# EAGLE design logger_2G_GSM (EAGLE 7.7.0)
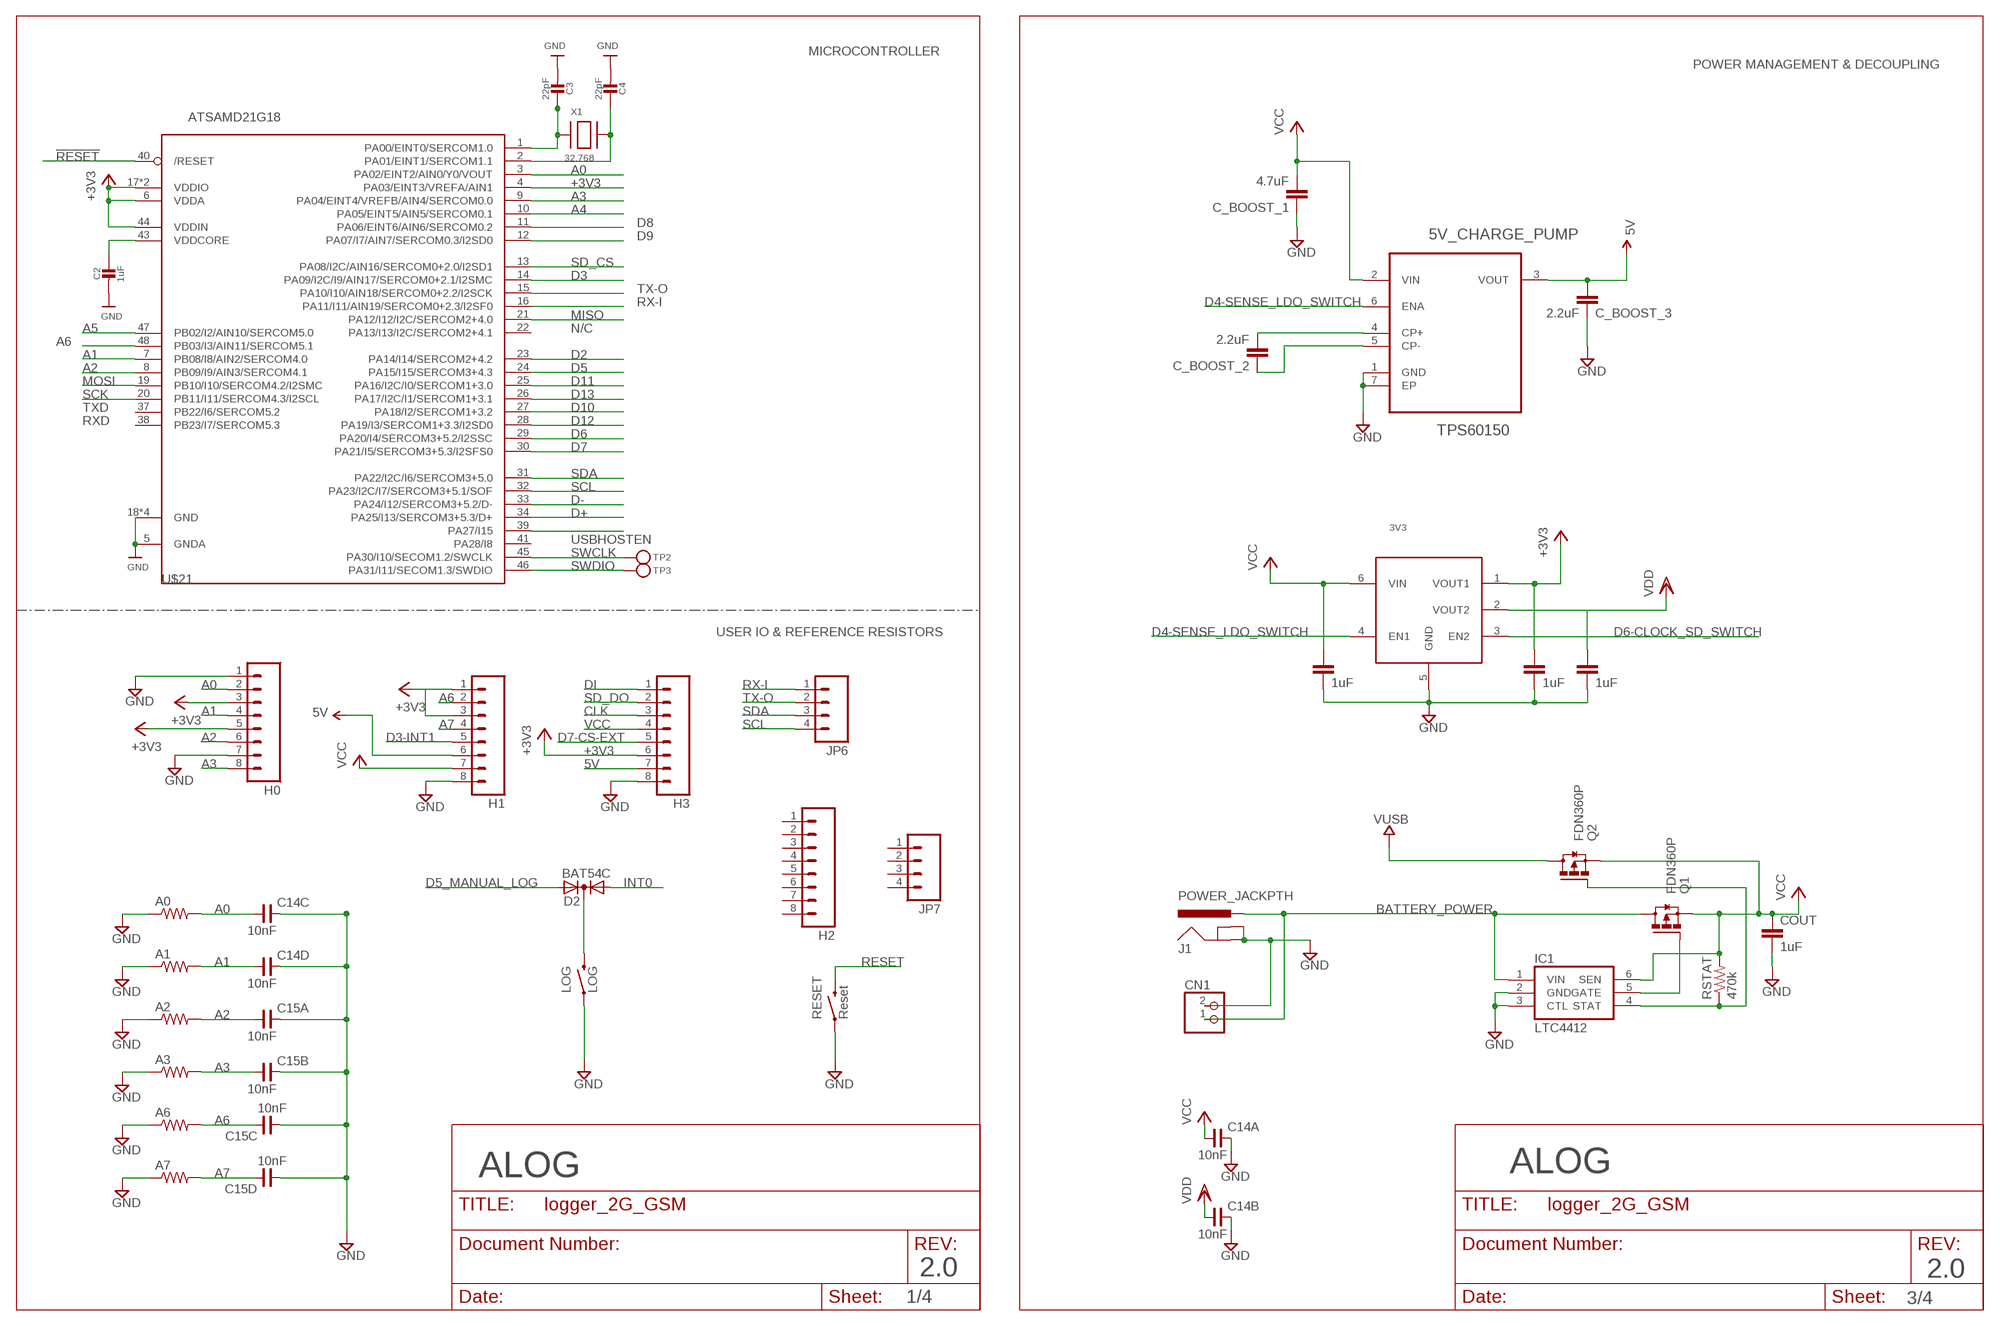
[diagram p0: schematic, sheet 1, part 1 of 2]
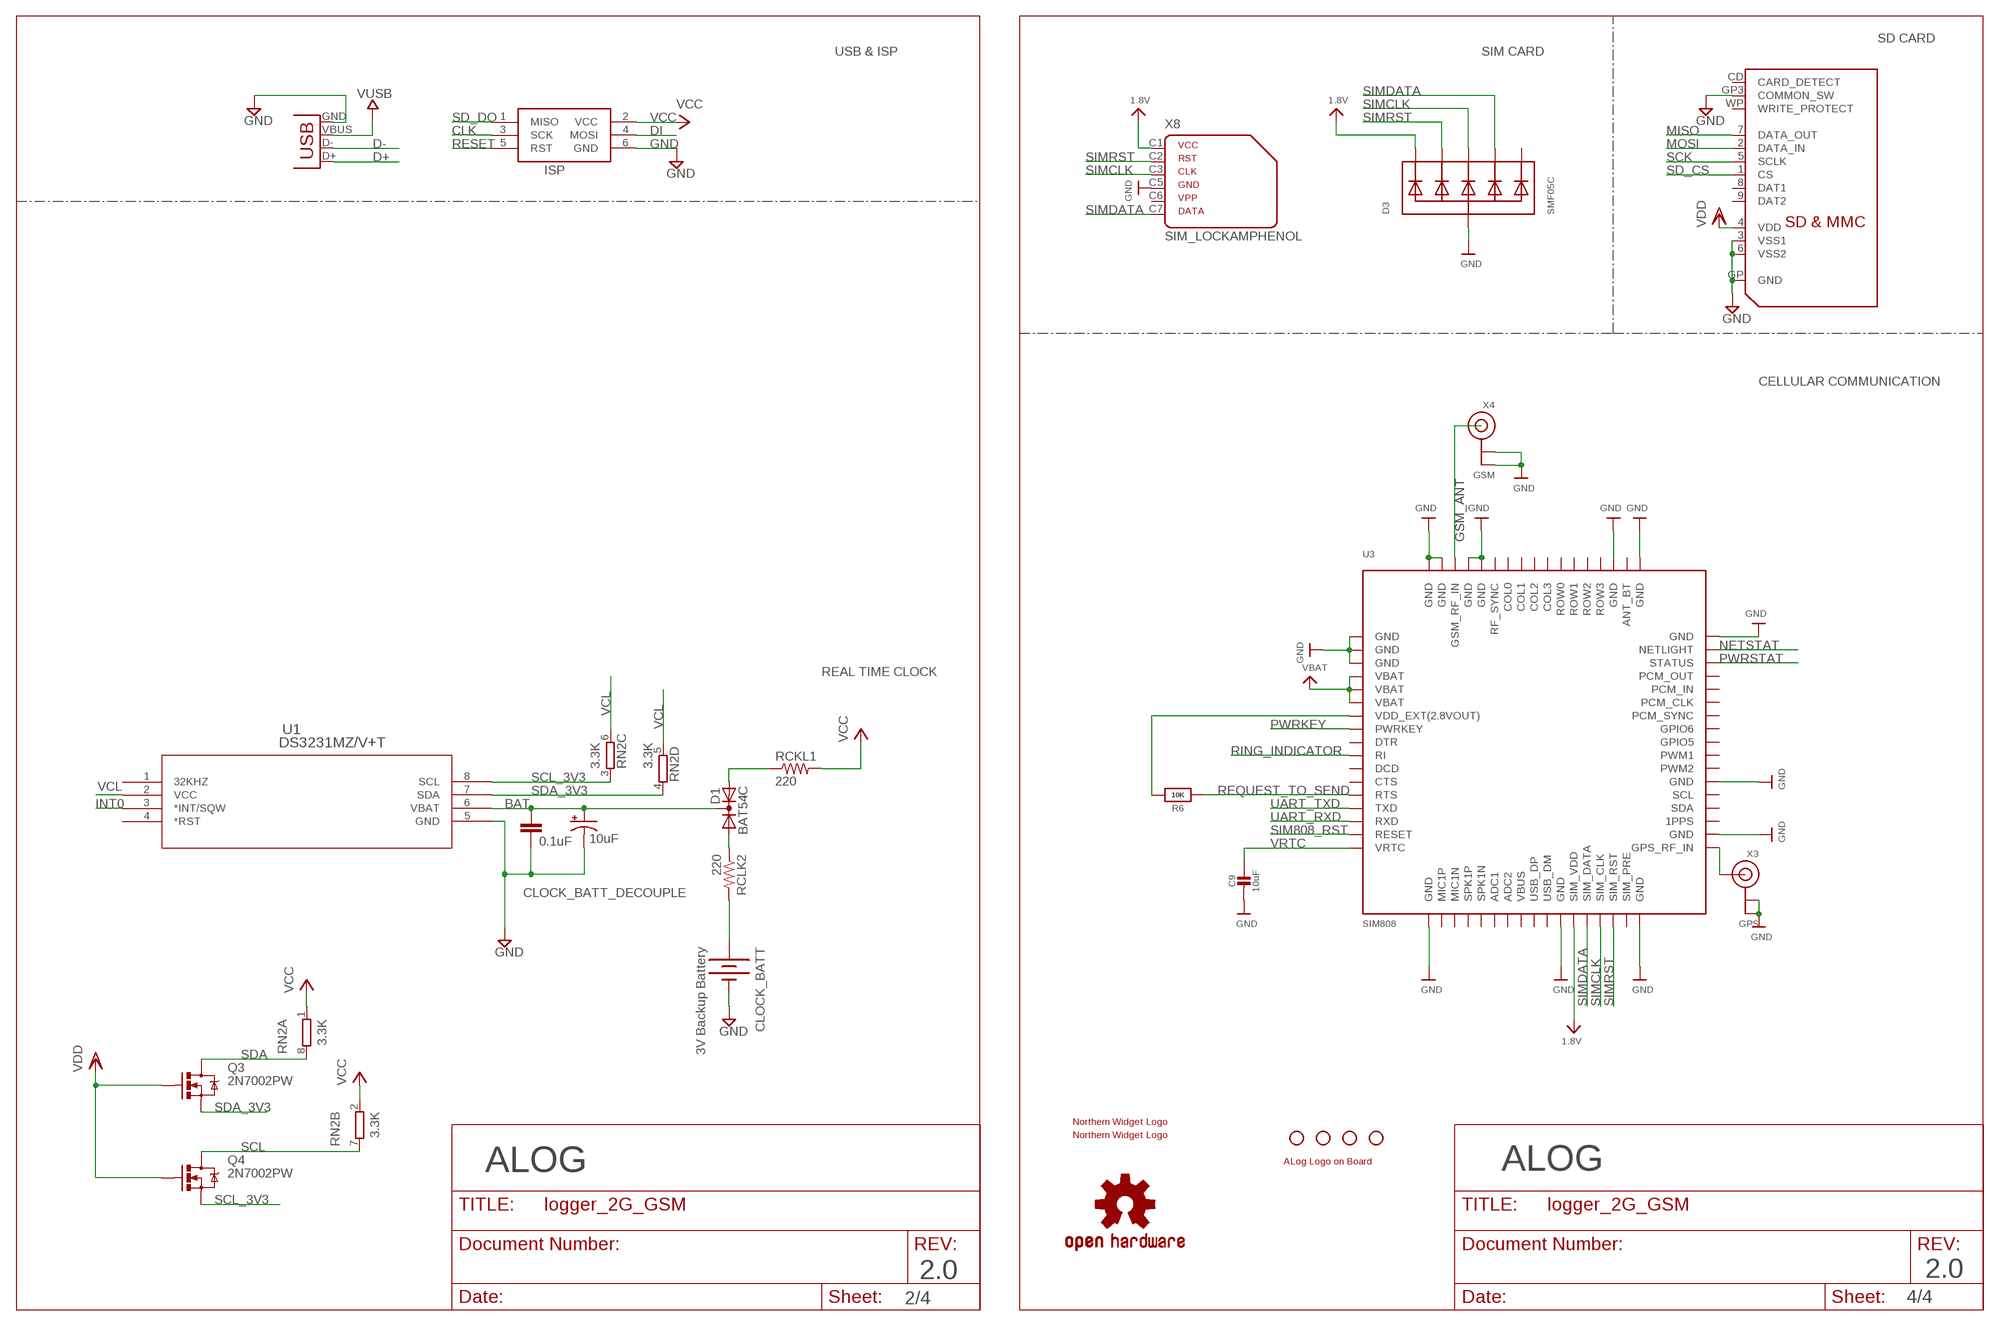
[diagram p1: schematic, sheet 1, part 2 of 2]

## Parts
3V3  MIC5380  [6-TMLF]
5V_CHARGE_PUMP  TPS60150  TPS60150DRVR  [SON65P200X200X80-7N]
A0  R-US_0207/10  [0207/10]
A1  R-US_0207/10  [0207/10]
A2  R-US_0207/10  [0207/10]
A3  R-US_0207/10  [0207/10]
A6  R-US_0207/10  [0207/10]
A7  R-US_0207/10  [0207/10]
C2  1uF  CAP_CERAMIC0603_NO  [0603-NO]
C3  22pF  CAP_CERAMIC0603_NO  [0603-NO]
C4  22pF  CAP_CERAMIC0603_NO  [0603-NO]
C9  10uF  CAP_CERAMIC0805-NOOUTLINE  [0805-NO]
C14  10nF  CCA_ECJ-1206  [CECJ-1206]
C15  10nF  CCA_ECJ-1206  [CECJ-1206]
C_BOOST_1  4.7uF  C-EUC0603  [C0603]
C_BOOST_2  2.2uF  C-EUC0603  [C0603]
C_BOOST_3  2.2uF  C-EUC0603  [C0603]
CLOCK_BATT  3V Backup Battery  BATTERY12PTH  [BATTCON_12MM_PTH]
CLOCK_BATT_DECOUP  0.1uF  C-EUC0603  [C0603]
CLOCK_BATT_DECOUPLE  10uF  CAP_POL1206  [EIA3216]
CLOCK_CIN1  1uF  C-EUC0603  [C0603]
CLOCK_CIN2  1uF  C-EUC0603  [C0603]
CLOCK_CIN3  1uF  C-EUC0603  [C0603]
CN1  JST_2PIN-THM  [JST-PH-2-THM]
COUT  1uF  C-EUC0603  [C0603]
D1  BAT54C  DIODE_AC-CA_  [SOT23C]
D2  BAT54C  DIODE_AC-CA_  [SOT23C]
D3  SMF05C  TVSARRAY_5LANE  [SOT363]
H0  M083.5MM-8  [SCREWTERMINAL-3.5MM-8]
H1  M083.5MM-8  [SCREWTERMINAL-3.5MM-8]
H2  M083.5MM-8  [SCREWTERMINAL-3.5MM-8]
H3  M083.5MM-8  [SCREWTERMINAL-3.5MM-8]
IC1  LTC4412  LTC4412ES6  [TSOT23-6]
ISP  AVRISP-6  [AVRISP]
J1  POWER_JACKPTH  [POWER_JACK_PTH]
JP1  STAND-OFF  [STAND-OFF]
JP2  STAND-OFF  [STAND-OFF]
JP3  STAND-OFF  [STAND-OFF]
JP4  STAND-OFF  [STAND-OFF]
JP5  USB-B  USBPTH  [USB-B-PTH]
JP6  M04SCREW  [SCREWTERMINAL-3.5MM-4]
JP7  M04SCREW  [SCREWTERMINAL-3.5MM-4]
LOG  LOG  SWITCH-MOMENTARY-2PTH  [TACTILE-PTH]
LOGO1  OSHW-LOGOM  [OSHW-LOGO-M]
Q1  FDN360P  [SUPER-SOT3]
Q2  FDN360P  [SUPER-SOT3]
Q3  2N7002PW  MOSFET-NCHANNELSOT323  [SOT323]
Q4  2N7002PW  MOSFET-NCHANNELSOT323  [SOT323]
R6  10K  RESISTOR0805_NOOUTLINE  [0805-NO]
RCKL1  220  R-US_R0603  [R0603]
RCLK2  220  R-US_R0603  [R0603]
RESET  Reset  SWITCH-MOMENTARY-2PTH  [TACTILE-PTH]
RN2  3.3K  4R-N0603-ARC  [0603-ARC]
RSTAT  470k  R-US_R0603  [R0603]
SD  SDMMC06132  [06132]
TP2  TESTPOINTROUND1.5MM  [TESTPOINT_ROUND_1.5MM]
TP3  TESTPOINTROUND1.5MM  [TESTPOINT_ROUND_1.5MM]
U1  DS3231MZ/V+T  [21-0041B_8]
U3  SIM808  GSM_SIM808_LITERAL  [SIM900_SMT]
U$1  NWLOGO  [NWLOGO]
U$2  ALOG_LOGO_V1_5.5MM  [ALOG_LOGO_V1_SMALL]
U$3  NWLOGO_MED  [NWLOGO_MED]
U$21  ATSAMD21G18  ATSAMD21J_QFN  [TQFN48_7MM]
X1  32.768  XTAL-3.2X1.5  [XTAL3215]
X3  GPS  ANTENNA_U.FL  [U.FL]
X4  GSM  ANTENNA_U.FL  [U.FL]
X8  SIM_LOCKAMPHENOL  [C707_10M006_512_2]

## Nets
1.8V: D3.1(C1) U3.P$29(SIM_VDD) X8.C1
5V: 5V_CHARGE_PUMP.3(VOUT) C_BOOST_3.2 H1.6 H3.7
!RESET: U$21.40(/RESET)
+3V3: 3V3.1(VOUT1) CLOCK_CIN2.1 H0.3 H0.5 H1.1 H1.3 H3.6 U$21.4(PA03/EINT3/VREFA/AIN1) U$21.6(VDDA) U$21.17(VDDIO) U$21.36(VDDIO) U$21.44(VDDIN)
A0: A0.2 C14.C1 H0.2 U$21.3(PA02/EINT2/AIN0/Y0/VOUT)
A1: A1.2 C14.D1 H0.4 U$21.7(PB08/I8/AIN2/SERCOM4.0)
A2: A2.2 C15.A1 H0.6 U$21.8(PB09/I9/AIN3/SERCOM4.1)
A3: A3.2 C15.B1 H0.8 U$21.9(PA04/EINT4/VREFB/AIN4/SERCOM0.0)
A4: U$21.10(PA05/EINT5/AIN5/SERCOM0.1)
A5: U$21.47(PB02/I2/AIN10/SERCOM5.0)
A6: A6.2 C15.C2 H1.2 U$21.48(PB03/I3/AIN11/SERCOM5.1)
A7: A7.2 C15.D2 H1.4
BAT: CLOCK_BATT_DECOUP.1 CLOCK_BATT_DECOUPLE.A(+) D1.3(K) U1.6(VBAT)
BATTERY_POWER: CN1.1 IC1.1(VIN) J1.PWR Q1.3(D)
CLK: H3.3 ISP.3(SCK)
D2: U$21.23(PA14/I14/SERCOM2+4.2)
D3: U$21.14(PA09/I2C/I9/AIN17/SERCOM0+2.1/I2SMC)
D3-INT1: H1.5
D4-SENSE_LDO_SWITCH: 3V3.4(EN1) 5V_CHARGE_PUMP.6(ENA)
D5: U$21.24(PA15/I15/SERCOM3+4.3)
D5_MANUAL_LOG: D2.2(A2)
D6: U$21.29(PA20/I4/SERCOM3+5.2/I2SSC)
D6-CLOCK_SD_SWITCH: 3V3.3(EN2)
D7: U$21.30(PA21/I5/SERCOM3+5.3/I2SFS0)
D7-CS-EXT: H3.5
D8: U$21.11(PA06/EINT6/AIN6/SERCOM0.2)
D9: U$21.12(PA07/I7/AIN7/SERCOM0.3/I2SD0)
D10: U$21.27(PA18/I2/SERCOM1+3.2)
D11: U$21.25(PA16/I2C/I0/SERCOM1+3.0)
D12: U$21.28(PA19/I3/SERCOM1+3.3/I2SD0)
D13: U$21.26(PA17/I2C/I1/SERCOM1+3.1)
D+: JP5.D+ U$21.34(PA25/I13/SERCOM3+5.3/D+)
D-: JP5.D- U$21.33(PA24/I12/SERCOM3+5.2/D-)
DI: H3.1 ISP.4(MOSI)
GND: 3V3.5(GND) 5V_CHARGE_PUMP.1(GND) 5V_CHARGE_PUMP.7(EP) A0.1 A1.1 A2.1 A3.1 A6.1 A7.1 C2.2 C3.2 C4.2 C9.2 C14.A2 C14.B2 C14.C2 C14.D2 C15.A2 C15.B2 C15.C1 C15.D1 C_BOOST_1.1 C_BOOST_3.1 CLOCK_BATT.GND(-) CLOCK_BATT_DECOUP.2 CLOCK_BATT_DECOUPLE.C(-) CLOCK_CIN1.2 CLOCK_CIN2.2 CLOCK_CIN3.2 CN1.2 COUT.2 D3.2(A) H0.1 H0.7 H1.8 H3.8 IC1.2(GND) IC1.3(CTL) ISP.6(GND) J1.GND J1.GNDBREAK JP5.GND LOG.1 RESET.1 SD.3(VSS1) SD.6(VSS2) SD.GP3(COMMON_SW) SD.GP(GND) U1.5(GND) U3.P$1(GND) U3.P$2(GND) U3.P$3(GND) U3.P$18(GND) U3.P$28(GND) U3.P$34(GND) U3.P$36(GND) U3.P$40(GND) U3.P$51(GND) U3.P$52(GND) U3.P$54(GND) U3.P$64(GND) U3.P$65(GND) U3.P$67(GND) U3.P$68(GND) U$21.5(GNDA) U$21.18(GND) U$21.35(GND) U$21.42(GND) U$21.THERMAL(GND) X3.1(GND) X3.2(GND) X4.1(GND) X4.2(GND) X8.C5
GSM_ANT: U3.P$66(GSM_RF_IN) X4.3(SIGNAL)
INT0: D2.1(A1) U1.3(*INT/SQW)
MISO: SD.7(DATA_OUT) U$21.21(PA12/I12/I2C/SERCOM2+4.0)
MOSI: SD.2(DATA_IN) U$21.19(PB10/I10/SERCOM4.2/I2SMC)
N$1: D1.1(A1) RCLK2.1
N$2: CLOCK_BATT.VCC@1(+) RCLK2.2
N$3: R6.2 U3.P$7(VDD_EXT(2.8VOUT))
N$6: U3.P$35(GPS_RF_IN) X3.3(SIGNAL)
N$7: IC1.4(STAT) Q2.1(G) RSTAT.1
N$8: IC1.5(GATE) Q1.1(G)
N$11: D2.3(K) LOG.3
N$14: 5V_CHARGE_PUMP.4(CP+) C_BOOST_2.2
N$15: 5V_CHARGE_PUMP.5(CP-) C_BOOST_2.1
N$17: C3.1 U$21.1(PA00/EINT0/SERCOM1.0) X1.P$1
N$19: C4.1 U$21.2(PA01/EINT1/SERCOM1.1) X1.P$2
N$21: U$21.39(PA27/I15)
N$67: D1.2(A2) RCKL1.1
NETSTAT: U3.P$50(NETLIGHT)
PWRKEY: U3.P$8(PWRKEY)
PWRSTAT: U3.P$49(STATUS)
REQUEST_TO_SEND: R6.1 U3.P$13(RTS)
RESET: ISP.5(RST) RESET.3
RING_INDICATOR: U3.P$10(RI)
RX-I: JP6.1 U$21.16(PA11/I11/AIN19/SERCOM0+2.3/I2SF0)
SCK: SD.5(SCLK) U$21.20(PB11/I11/SERCOM4.3/I2SCL)
SCL: JP6.4 Q4.3(D) RN2.7 U$21.32(PA23/I2C/I7/SERCOM3+5.1/SOF)
SCL_3V3: Q4.2(S) RN2.3 U1.8(SCL)
SD_CS: SD.1(CS) U$21.13(PA08/I2C/AIN16/SERCOM0+2.0/I2SD1)
SD_DO: H3.2 ISP.1(MISO)
SDA: JP6.3 Q3.3(D) RN2.8 U$21.31(PA22/I2C/I6/SERCOM3+5.0)
SDA_3V3: Q3.2(S) RN2.4 U1.7(SDA)
SIM808_RST: U3.P$16(RESET)
SIMCLK: D3.4(C3) U3.P$31(SIM_CLK) X8.C3
SIMDATA: D3.5(C4) U3.P$30(SIM_DATA) X8.C7
SIMRST: D3.3(C2) U3.P$32(SIM_RST) X8.C2
SWCLK: TP2.P$1 U$21.45(PA30/I10/SECOM1.2/SWCLK)
SWDIO: TP3.P$1 U$21.46(PA31/I11/SECOM1.3/SWDIO)
TX-O: JP6.2 U$21.15(PA10/I10/AIN18/SERCOM0+2.2/I2SCK)
UART_RXD: U3.P$15(RXD)
UART_TXD: U3.P$14(TXD)
VBAT: U3.P$4(VBAT) U3.P$5(VBAT) U3.P$6(VBAT)
VCC: 3V3.6(VIN) 5V_CHARGE_PUMP.2(VIN) C14.A1 C_BOOST_1.2 CLOCK_CIN1.1 COUT.1 H1.7 H3.4 IC1.6(SEN) ISP.2(VCC) Q1.2(S) Q2.2(S) RCKL1.2 RN2.1 RN2.2 RSTAT.2
VCL: RN2.5 RN2.6 U1.2(VCC)
VDD: 3V3.2(VOUT2) C14.B1 CLOCK_CIN3.1 Q3.1(G) Q4.1(G) SD.4(VDD)
VDDCORE: C2.1 U$21.43(VDDCORE)
VRTC: C9.1 U3.P$17(VRTC)
VUSB: JP5.VBUS Q2.3(D)
Unconnected: D3.6(C5) H2.1 H2.2 H2.3 H2.4 H2.5 H2.6 H2.7 H2.8 JP7.1 JP7.2 JP7.3 JP7.4 SD.8(DAT1) SD.9(DAT2) SD.CD(CARD_DETECT) SD.WP(WRITE_PROTECT) U1.1(32KHZ) U1.4(*RST) U3.P$9(DTR) U3.P$11(DCD) U3.P$12(CTS) U3.P$19(MIC1P) U3.P$20(MIC1N) U3.P$21(SPK1P) U3.P$22(SPK1N) U3.P$23(ADC1) U3.P$24(ADC2) U3.P$26(USB_DP) U3.P$27(USB_DM) U3.P$33(SIM_PRE) U3.P$37(1PPS) U3.P$38(SDA) U3.P$39(SCL) U3.P$41(PWM2) U3.P$42(PWM1) U3.P$43(GPIO5) U3.P$44(GPIO6) U3.P$45(PCM_SYNC) U3.P$46(PCM_CLK) U3.P$47(PCM_IN) U3.P$48(PCM_OUT) U3.P$53(ANT_BT) U3.P$55(ROW3) U3.P$56(ROW2) U3.P$57(ROW1) U3.P$58(ROW0) U3.P$59(COL3) U3.P$60(COL2) U3.P$61(COL1) U3.P$62(COL0) U3.P$63(RF_SYNC) U$21.22(PA13/I13/I2C/SERCOM2+4.1) U$21.37(PB22/I6/SERCOM5.2) U$21.38(PB23/I7/SERCOM5.3) U$21.41(PA28/I8) X8.C6

## Notes on the sheet
- MICROCONTROLLER
- POWER MANAGEMENT & DECOUPLING
- N/C
- TXD
- RXD
- USBHOSTEN
- USER IO & REFERENCE RESISTORS
- ALOG | ALOG
- 2.0 | 2.0
- 1/4 | 3/4
- SD CARD
- USB & ISP | SIM CARD
- CELLULAR COMMUNICATION
- REAL TIME CLOCK
- ALOG | ALOG
- 2.0 | 2.0
- 2/4 | 4/4

## Power pins joined to a net without a drawn wire
VBUS: U3.P$25(VBUS)

## Library data of the parts
3V3 = csandell:MIC5380: Duel 3.3V Low drop out regulator. Digikey: 576-3453-1-ND
5V_CHARGE_PUMP = ti_by_element14:TPS60150DRVR: Charge Pump Device; MPN: TPS60150DRVR; OC_FARNELL: -; OC_NEWARK: 45P8283; PACKAGE: SON-6; SUPPLIER: Texas Instruments
A0 A1-A3 A6 A7 = resistor:R-US_: RESISTOR, American symbol
C2-C4 C9 = microbuilder:CAP_CERAMIC: Ceramic Capacitors For new designs, use the packages preceded by an '_' character since they are more reliable: The following footprints should be used on most boards: _0402 - Standard footprint for regular board layouts _0603 - Standard footprint for regular board layouts _0805 - Standard footprint for regular board layouts _1206 - Standard footprint for regular board layouts For extremely tight-pitch boards where space is at a premium, the following 'micro-pitch' footprints can be used (smaller pads, no silkscreen outline, etc.): _0402MP - Micro-pitch footprint for very dense/compact boards _0603MP - Micro-pitch footprint for very dense/compact boards _0805MP - Micro-pitch footprint for very dense/compact boards _1206MP - Micro-pitch footprint for very dense/compact boards
C14 C15 = rc-master-smd:CCA_: CHIP CAP ARRAY
C_BOOST_1-C_BOOST_3 = resistor:C-EU: CAPACITOR, European symbol
CLOCK_BATT = SparkFun:BATTERY: Battery Holders Various common sizes : AA, AAA, 20mm coin cell and 12mm coin cell.
CLOCK_BATT_DECOUP CLOCK_CIN1-CLOCK_CIN3 COUT = rcl:C-EU: CAPACITOR, European symbol
CLOCK_BATT_DECOUPLE = SparkFun-Passives:CAP_POL: Capacitor Polarized These are standard SMD and PTH capacitors. Normally 10uF, 47uF, and 100uF in electrolytic and tantalum varieties. Always verify the external diameter of the through hole cap, it varies with capacity, voltage, and manufacturer. The EIA devices should be standard.
CN1 = adafruit:JST_2PIN: JST 2-Pin Connectors of various flavors SMT-RA (S2B-PH-SM4) 4UConnector #17311 SMT (B2B-PH-SM4) THM-RA (S2B-PH) THM (B2B-PH)
D1 D2 = semicon-smd-ipc:DIODE_AC-CA_: DUAL DIODE
D3 = microbuilder:TVSARRAY_5LANE: Voltage Transient Suppressor Array SOT363 SMF05C - 100W 5V: Digikey - SMF05CT1GOSCT-ND
H0 H1-H3 = SparkFun:M08: Header 8 Standard 8-pin 0.1" header. Use with straight break away headers (SKU : PRT-00116), right angle break away headers (PRT-00553), swiss pins (PRT-00743), machine pins (PRT-00117), and female headers (PRT-00115).
IC1 = awickert:LTC4412*: Low Loss PowerPath Controller
ISP = adafruit:AVRISP: AVR ISP HEADER Standard 6 pin header for AVR programming
J1 = SparkFun:POWER_JACK: Power Jack This is the standard 5.5mm barrel jack for power. The PTH is the most common, proven, reliable, footprint. All others are experimental. The Slot footprint only works if the mill layer is transmitted to the PCB fab house so be warned. Spark Fun Electronics SKU : PRT-00119. Mating wall wart : TOL-00298 (and others)
JP1-JP4 = SparkFun:STAND-OFF: Stand Off This is the mechanical footprint for a #4 phillips button head screw. Use the keepout ring to avoid running the screw head into surrounding components. SKU : PRT-00447
JP5 = SparkFun-Connectors:USB: USB Connectors USB-B-PTH is fully proven SKU : PRT-00139/CONN-08278 USB-miniB is fully proven SKU : PRT-00587 USB-A-PCB is untested. USB-A-H is throughly reviewed, but untested. Spark Fun Electronics SKU : PRT-00437 USB-B-SMT is throughly reviewed, but untested. Needs silkscreen touching up. USB-A-S has not been used/tested USB-MB-H has not been used/tested USB-MICROB has been used. CONN-09505; PROD_ID: CONN-08278
JP6 JP7 = SparkFun-Connectors:M04: Header 4 Standard 4-pin 0.1" header. Use with straight break away headers (SKU : PRT-00116), right angle break away headers (PRT-00553), swiss pins (PRT-00743), machine pins (PRT-00117), and female headers (PRT-00115). Molex polarized connector foot print use with SKU : PRT-08231 with associated crimp pins and housings. 1MM SMD Version SKU: PRT-10208; PROD_ID: Combine 2x8399
LOG RESET = SparkFun-Electromechanical:SWITCH-MOMENTARY-2: Various NO switches- pushbuttons, reed, etc; PROD_ID: SWCH-08441
LOGO1 = SparkFun-Aesthetics:OSHW-LOGO: Open Source Hardware Logo This logo indicates the piece of hardware it is found on incorporates a OSHW license and/or adheres to the definition of open source hardware found here: http://freedomdefined.org/OSHW
Q1 Q2 = transistor-power:FDN360P: Single P-Channel, PowerTrench (R) MOSFET Source: http://www.fairchildsemi.com/ds/FD/FDN360P.pdf
Q3 Q4 = SparkFun-DiscreteSemi:MOSFET-NCHANNEL: Generic NMOS footprint
R6 = microbuilder:RESISTOR: Resistors For new designs, use the packages preceded by an '_' character since they are more reliable: The following footprints should be used on most boards: _0402 - Standard footprint for regular board layouts _0603 - Standard footprint for regular board layouts _0805 - Standard footprint for regular board layouts _1206 - Standard footprint for regular board layouts For extremely tight-pitch boards where space is at a premium, the following 'micro-pitch' footprints can be used (smaller pads, no silkscreen outline, etc.): _0402MP - Micro-pitch footprint for very dense/compact boards _0603MP - Micro-pitch footprint for very dense/compact boards _0805MP - Micro-pitch footprint for very dense/compact boards _1206MP - Micro-pitch footprint for very dense/compact boards
RCKL1 RCLK2 RSTAT = rcl:R-US_: RESISTOR, American symbol
RN2 = resistor-dil:4R-N: Array Chip Resistor Source: RS Component / Phycomp; OC_FARNELL: unknown; OC_NEWARK: unknown
SD = adafruit:SDMMC: SD MMC Card holder 4UCON part #06132 - easy to solder
TP2 TP3 = microbuilder:TESTPOINT: Test Point Various test points for characterisation and PCB testing TESTPOINT_SMT - Compact Surface Mount Test Point [Digikey: 5016KTR-ND]
U1 = Maxim-DS3231MZ_8-SOIC:DS3231MZ/V+T; MANUFACTURER_NAME: Maxim; MANUFACTURER_PART_NUMBER: DS3231MZ/V+T; VENDOR: Maxim
U3 = microbuilder:GSM_SIM808_LITERAL: SIM808 GSM Module
U$1 = awickert:NWLOGO
U$2 = awickert:ALOG_LOGO_V1_5.5MM
U$3 = awickert:NWLOGO_MED: Medium-sized Northern Widget logo
U$21 = microbuilder:ATSAMD21J
X1 = adafruit2:XTAL: Low cost SMT crystals, no capacitors included http://www.ladyada.net/library/eagle
X3 X4 = microbuilder:ANTENNA_U.FL: U.FL Antenna Connector
X8 = microbuilder:SIM_LOCK: C707A SIMLOCK® 2.5 mm with wide solder tails Source: Data sheet <http://www.amphenol.info/downloads/C707_10M006_512_2.pdf>; OC_FARNELL: unknown; OC_NEWARK: unknown

## Net classes
0 default: width 0.203 mm, drill 0.305 mm
1 power: width 0.305 mm, drill 0.508 mm
2 gnd: width 0.61 mm, drill 0.508 mm, clearance 0.203 mm
3 usbvcc: width 0.508 mm, drill 0.508 mm, clearance 0.152 mm
4 aref: width 0.406 mm

## Board
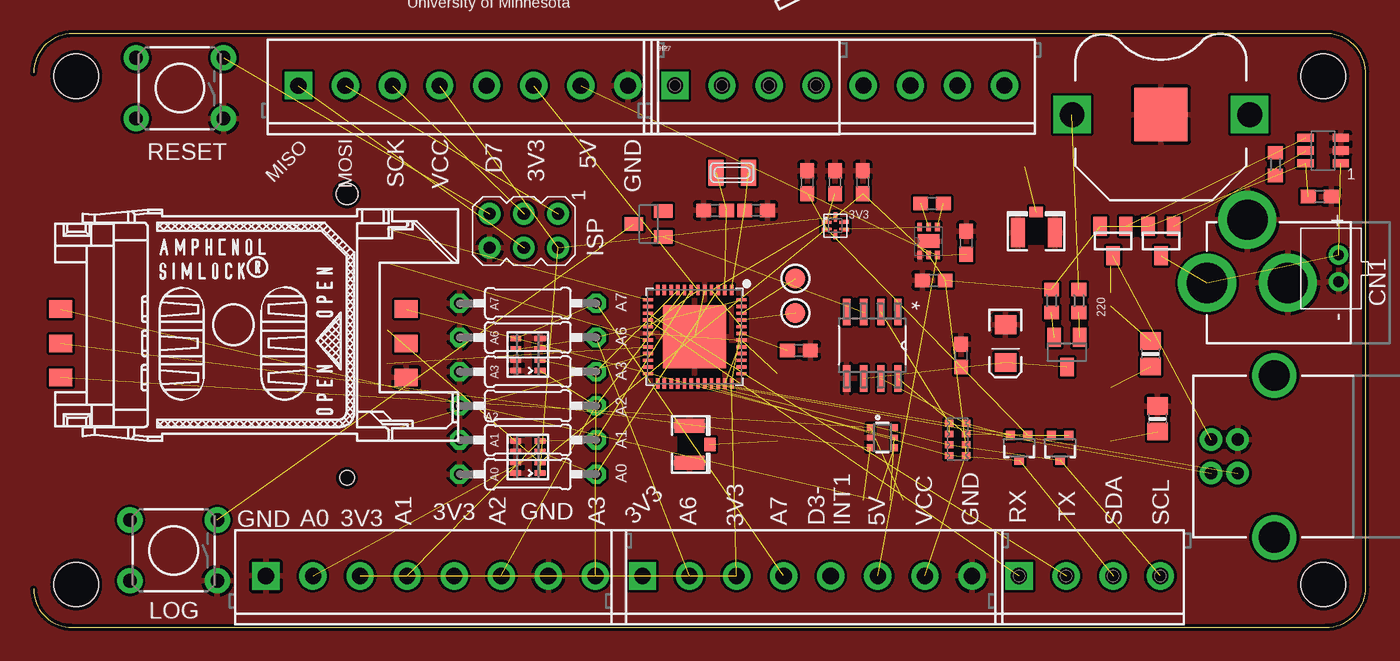
[diagram p2: board, top side]
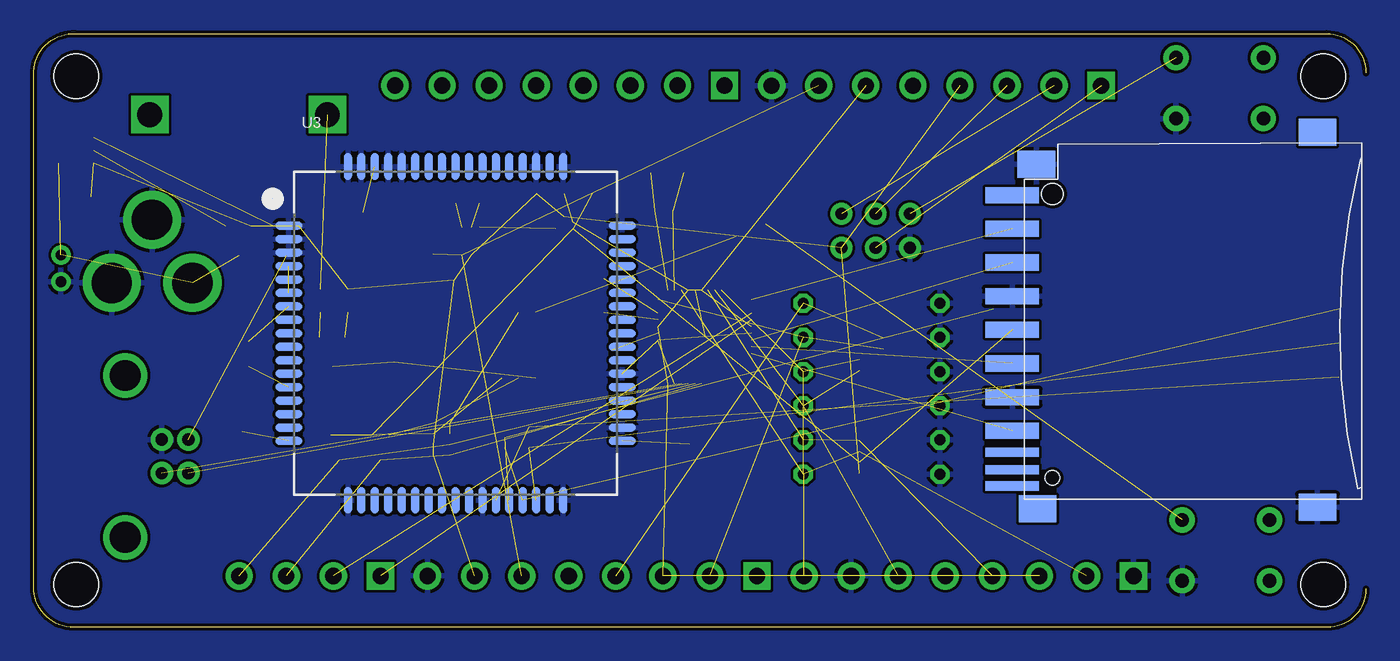
[diagram p3: board, bottom side, seen from below]

Size 99.06 x 44.12 mm. Coordinates in mm from the lower left corner, seen from the top.
Outline: 0,41.21 arc-90 2.92,44.12 95.94,44.12 arc-90 99.06,41.32 99.06,2.98 arc-90 96.08,0 2.86,0 arc-90 0,2.85
Copper layers (1*16): Top 0.035mm / dielectric 1.5mm / Bottom 0.035mm
Design rules "SparkFun *": minimum track width 8mil, minimum drill 12mil, track to track 8mil, track to pad 8mil, pad to pad 8mil, via to via 8mil, smd to smd 8mil, copper to edge 10mil, drill to drill 8mil, minimum pad ring 12mil, minimum via ring 10mil, stop-mask expansion 4mil, vias tented up to drill 25mil, thermal gap 10mil

### Footprints (pad centres in the part's own frame; a part is rotated, then mirrored left to right if it is on the bottom)
6-TMLF = smd 0.7 x 0.2: 1 -0.65,0.25; 2 -0.65,-0.25; 4 0.65,-0.25; 5 0.65,0.25 | smd 0.2 x 0.7: 3 0,-0.65; 6 0,0.65
SON65P200X200X80-7N = smd 0.61 x 0.356: 1 -1.041,0.66; 2 -1.041,0; 3 -1.041,-0.66; 4 1.041,-0.66; 5 1.041,0; 6 1.041,0.66 | smd 0.991 x 1.6: 7 0,0
0207/10 = drill 0.813 octagon: 1 -5.08,0; 2 5.08,0
0603-NO = smd 1.1 x 1: 1 -0.85,0; 2 0.85,0
0805-NO = smd 1.3 x 1.5: 1 -0.95,0; 2 0.95,0
CECJ-1206 = smd 0.406 x 0.813: A1 -1.2,-0.9; A2 -1.2,0.9; B1 -0.4,-0.9; B2 -0.4,0.9; C1 0.4,-0.9; C2 0.4,0.9; D1 1.2,-0.9; D2 1.2,0.9
C0603 = smd 1.1 x 1: 1 -0.85,0; 2 0.85,0
BATTCON_12MM_PTH = smd 3.962 x 3.962: GND 0,0 | drill 1.854 square: VCC@1 -6.604,0; VCC@2 6.604,0
EIA3216 = smd 1.4 x 1.6: A 1.4,0; C -1.4,0
JST-PH-2-THM = drill 0.8 pad 1.422: 1 1,0; 2 -1,0
SOT23C = smd 1 x 1.4: 1 -0.95,-1.1; 2 0.95,-1.1; 3 0,1.1
SOT363 = smd 0.5 x 0.5: 1 -0.75,-0.9; 3 0.75,-0.9; 4 0.75,0.9; 6 -0.75,0.9 | smd 0.4 x 0.5: 2 0,-0.9; 5 0,0.9
SCREWTERMINAL-3.5MM-8 = drill 1.2 pad 2.032 square: 1 0,0 | drill 1.2 pad 2.032: 2 3.5,0; 3 7,0; 4 10.5,0; 5 14,0; 6 17.5,0; 7 21,0; 8 24.5,0
TSOT23-6 = smd 0.622 x 1.22: 1 -0.95,-1.31; 2 0,-1.31; 3 0.95,-1.31; 4 0.95,1.31; 5 0,1.31; 6 -0.95,1.31
AVRISP = drill 0.9 pad 1.626: 1 -1.27,2.54; 2 1.27,2.54; 3 -1.27,0; 4 1.27,0; 5 -1.27,-2.54; 6 1.27,-2.54
POWER_JACK_PTH = drill 2.997 pad 4.318: GND 0,7.7; GNDBREAK 4.7,10.7; PWR 0,13.7
STAND-OFF = hole 3.302: 0,0
USB-B-PTH = drill 0.914 pad 1.676: D+ 0,1.25; D- 1.981,1.25; GND 0,-1.25; VBUS 1.981,-1.25 | drill 2.286: S1 -2.718,-6.02; S2 -2.718,6.02
SCREWTERMINAL-3.5MM-4 = drill 1.2 pad 2.032 square: 1 0,0 | drill 1.2 pad 2.032: 2 3.5,0; 3 7,0; 4 10.5,0
TACTILE-PTH = drill 1.016 pad 1.88: 1 -3.251,2.261; 2 3.251,2.261; 3 -3.251,-2.261; 4 3.251,-2.261
SUPER-SOT3 = smd 1 x 1.4: 1 -0.95,-1.1; 2 0.95,-1.1; 3 0,1.1
SOT323 = smd 0.7 x 0.7: 1 -0.65,-0.925; 2 0.65,-0.925; 3 0,0.925
R0603 = smd 1 x 1.1: 1 -0.85,0; 2 0.85,0
0603-ARC = smd 0.5 x 0.65: 1 -1.2,-0.625; 2 -0.4,-0.625; 3 0.4,-0.625; 4 1.2,-0.625; 5 1.2,0.625; 6 0.4,0.625; 7 -0.4,0.625; 8 -1.2,0.625
06132 = smd 1.2 x 4: 1 6.9,0.9; 2 4.4,0.9; 3 1.9,0.9; 4 -0.6,0.9; 5 -3.1,0.9; 6 -5.6,0.9; 7 -8.1,0.9; 9 9.4,0.9 | smd 0.7 x 4: 8 -9.7,0.9; CD -11,0.9; WP -12.2,0.9 | smd 2 x 2.8: GP -13.8,-21.8; GP2 14.1,-21.8; GP3 11.7,-0.9; GP4 -13.9,-1 | hole 1.1: -11.6,-2.1 | hole 1.6: 9.5,-2.1
TESTPOINT_ROUND_1.5MM = smd 1.5 x 1.5: P$1 0,0
21-0041B_8 = smd 1.981 x 0.533: 1 -2.464,1.905; 2 -2.464,0.635; 3 -2.464,-0.635; 4 -2.464,-1.905; 5 2.464,-1.905; 6 2.464,-0.635; 7 2.464,0.635; 8 2.464,1.905
SIM900_SMT = smd 2 x 0.6: P$1 -12.4,8; P$2 -12.4,7; P$3 -12.4,6; P$4 -12.4,5; P$5 -12.4,4; P$6 -12.4,3; P$7 -12.4,2; P$8 -12.4,1; P$9 -12.4,0; P$10 -12.4,-1; P$11 -12.4,-2; P$12 -12.4,-3; P$13 -12.4,-4; P$14 -12.4,-5; P$15 -12.4,-6; P$16 -12.4,-7; P$17 -12.4,-8; P$35 12.4,-8; P$36 12.4,-7; P$37 12.4,-6; P$38 12.4,-5; P$39 12.4,-4; P$40 12.4,-3; P$41 12.4,-2; P$42 12.4,-1; P$43 12.4,0; P$44 12.4,1; P$45 12.4,2; P$46 12.4,3; P$47 12.4,4; P$48 12.4,5; P$49 12.4,6; P$50 12.4,7; P$51 12.4,8 | smd 0.6 x 2: P$18 -8,-12.4; P$19 -7,-12.4; P$20 -6,-12.4; P$21 -5,-12.4; P$22 -4,-12.4; P$23 -3,-12.4; P$24 -2,-12.4; P$25 -1,-12.4; P$26 0,-12.4; P$27 1,-12.4; P$28 2,-12.4; P$29 3,-12.4; P$30 4,-12.4; P$31 5,-12.4; P$32 6,-12.4; P$33 7,-12.4; P$34 8,-12.4; P$52 8,12.4; P$53 7,12.4; P$54 6,12.4; P$55 5,12.4; P$56 4,12.4; P$57 3,12.4; P$58 2,12.4; P$59 1,12.4; P$60 0,12.4; P$61 -1,12.4; P$62 -2,12.4; P$63 -3,12.4; P$64 -4,12.4; P$65 -5,12.4; P$66 -6,12.4; P$67 -7,12.4; P$68 -8,12.4
TQFN48_7MM = smd 0.25 x 0.75: 1 -2.75,-3.475; 2 -2.25,-3.475; 3 -1.75,-3.475; 4 -1.25,-3.475; 5 -0.75,-3.475; 6 -0.25,-3.475; 7 0.25,-3.475; 8 0.75,-3.475; 9 1.25,-3.475; 10 1.75,-3.475; 11 2.25,-3.475; 12 2.75,-3.475; 25 2.75,3.475; 26 2.25,3.475; 27 1.75,3.475; 28 1.25,3.475; 29 0.75,3.475; 30 0.25,3.475; 31 -0.25,3.475; 32 -0.75,3.475; 33 -1.25,3.475; 34 -1.75,3.475; 35 -2.25,3.475; 36 -2.75,3.475 | smd 0.75 x 0.25: 13 3.475,-2.75; 14 3.475,-2.25; 15 3.475,-1.75; 16 3.475,-1.25; 17 3.475,-0.75; 18 3.475,-0.25; 19 3.475,0.25; 20 3.475,0.75; 21 3.475,1.25; 22 3.475,1.75; 23 3.475,2.25; 24 3.475,2.75; 37 -3.475,2.75; 38 -3.475,2.25; 39 -3.475,1.75; 40 -3.475,1.25; 41 -3.475,0.75; 42 -3.475,0.25; 43 -3.475,-0.25; 44 -3.475,-0.75; 45 -3.475,-1.25; 46 -3.475,-1.75; 47 -3.475,-2.25; 48 -3.475,-2.75 | smd 4.7 x 4.7: THERMAL 0,0
XTAL3215 = smd 1.1 x 1.9: P$1 1.2,0; P$2 -1.2,0
U.FL = smd 2.2 x 1.05: 1 0,1.375; 2 0,-1.375 | smd 0.8 x 1: 3 1.525,0
C707_10M006_512_2 = smd 1.7 x 1.3: C1 -12.85,-3.915; C2 -12.85,-1.375; C3 -12.85,1.165; C5 12.85,-3.915; C6 12.85,-1.375; C7 12.85,1.165

### Placement (x,y rotation side)
3V3  59.61,29.86 0 top
5V_CHARGE_PUMP  66.55,28.7 90 top
A0  36.76,11.38 0 top
A1  36.76,13.92 0 top
A2  36.76,16.46 0 top
A3  36.76,19 0 top
A6  36.76,21.54 0 top
A7  36.76,24.08 0 top
C2  56.9,20.57 0 top
C3  53.72,30.99 0 top
C4  50.67,30.99 180 top
C9  83.57,15.49 90 top
C14  36.76,12.65 90 top
C15  36.76,20.27 90 top
C_BOOST_1  66.93,25.78 0 top
C_BOOST_2  66.8,31.5 0 top
C_BOOST_3  69.34,28.57 270 top
CLOCK_BATT  83.82,38.1 0 top
CLOCK_BATT_DECOUP  68.96,20.19 90 top
CLOCK_BATT_DECOUPLE  72.26,21.08 270 top
CLOCK_CIN1  61.65,33.08 90 top
CLOCK_CIN2  59.59,33.08 90 top
CLOCK_CIN3  57.53,33.08 90 top
CN1  97.03,26.67 90 top
COUT  95.63,32 0 top
D1  76.83,20.45 180 top
D2  45.72,29.97 90 top
D3  63.12,14.1 270 top
H0  17.27,3.81 0 top
H1  45.27,3.81 0 top
H2  47.69,40.27 0 top
H3  19.68,40.26 0 top
IC1  95.89,35.43 90 top
ISP  36.45,29.46 270 top
J1  100.95,25.59 90 top
JP1  3.17,3.17 0 top
JP2  95.89,40.96 90 top
JP3  95.89,3.17 90 top
JP4  3.17,40.96 0 top
JP5  89.53,12.7 180 top
JP6  73.27,3.81 0 top
JP7  47.69,40.26 0 top
LOG  10.41,5.71 180 top
LOGO1  78.42,49.27 90 top  (outside the outline)
Q1  83.82,28.7 180 top
Q2  80.26,28.7 180 top
Q3  73.28,13.34 180 top
Q4  76.33,13.34 180 top
R6  83.06,20.32 90 top
RCKL1  75.69,24.26 90 top
RCLK2  77.72,24.26 90 top
RESET  10.87,40.07 180 top
RN2  68.71,13.97 90 top
RSTAT  92.33,34.42 270 top
SD  25.4,22.71 90 bottom
TP2  56.64,23.37 0 top
TP3  56.64,25.91 0 top
U1  62.36,20.95 270 top
U3  67.69,21.84 0 bottom
U$1  14.86,56.75 0 top  (outside the outline)
U$2  68.33,50.27 90 top  (outside the outline)
U$3  57.25,49.47 90 top  (outside the outline)
U$21  49.15,21.59 180 top
X1  51.94,33.78 0 top
X3  48.77,13.59 0 top
X4  74.55,29.34 90 top
X8  14.86,22.48 0 top

### Tracks (layer width: path | path; a pad name or v marks a point on that pad's centre or on a via)
1.8V  (2 unrouted)
5V  (3 unrouted)
+3V3  (11 unrouted)
A0  (3 unrouted)
A1  (3 unrouted)
A2  (3 unrouted)
A3  (3 unrouted)
A6  (3 unrouted)
A7  (2 unrouted)
BAT  (3 unrouted)
BATTERY_POWER  (3 unrouted)
CLK  (1 unrouted)
D4-SENSE_LDO_SWITCH  (1 unrouted)
D+  (1 unrouted)
D-  (1 unrouted)
DI  (1 unrouted)
GND  (5 unrouted)
  pour Bottom: -20,70 -20,-20 145,-20 145,70
  pour Top: -25,75 -25,-25 150,-25 150,75
GSM_ANT  (1 unrouted)
INT0  (1 unrouted)
MISO  (1 unrouted)
MOSI  (1 unrouted)
N$1  (1 unrouted)
N$2  (1 unrouted)
N$3  (1 unrouted)
N$6  (1 unrouted)
N$7  (2 unrouted)
N$8  (1 unrouted)
N$11  (1 unrouted)
N$14  (1 unrouted)
N$15  (1 unrouted)
N$17  (2 unrouted)
N$19  (2 unrouted)
N$67  (1 unrouted)
REQUEST_TO_SEND  (1 unrouted)
RESET  (1 unrouted)
RX-I  (1 unrouted)
SCK  (1 unrouted)
SCL  (3 unrouted)
SCL_3V3  (2 unrouted)
SD_CS  (1 unrouted)
SD_DO  (1 unrouted)
SDA  (3 unrouted)
SDA_3V3  (2 unrouted)
SIMCLK  (2 unrouted)
SIMDATA  (2 unrouted)
SIMRST  (2 unrouted)
SWCLK  (1 unrouted)
SWDIO  (1 unrouted)
TX-O  (1 unrouted)
VBAT  (2 unrouted)
VCC  (15 unrouted)
VCL  (2 unrouted)
VDD  (5 unrouted)
VDDCORE  (1 unrouted)
VRTC  (1 unrouted)
VUSB  (1 unrouted)

### Text on the board
tPlace: TM | TM | TM | v. 1.4.1 / 09 August 2016 / Andy Wickert / Chad Sandell / University of Minnesota | MISO | MOSI | SCK | VCC | D7 | 3V3 | 5V | GND | 1 | A7 | A6 | A3 | A2 | A1 | A0 | GND | A0 | 3V3 | A1 | 3V3 | A2 | GND | A3 | 3V3 | A6 | 3V3 | A7 | D3- / INT1 | 5V | VCC | GND | RX | TX | SDA | SCL